# Altium schematic sheet USBC.SchDoc
size A
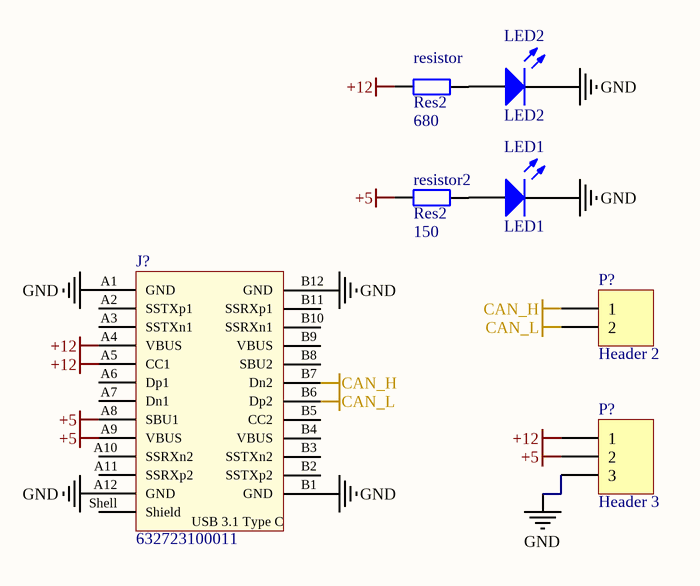
[diagram p0: USBC.SchDoc]

## Parts
(Parts that share a designator on the sheet are numbered #1, #2 ... from top to bottom, then left to right.)
J?  632723100011  [632723100011]
LED1  LED1  [LED-1]
LED2  LED2  [LED-1]
P?#1  Header 2  [HDR1X2]
P?#2  Header 3  [HDR1X3]
resistor  Res2  value 680  [AXIAL-0.4]
resistor2  Res2  value 150  [AXIAL-0.4]

## Nets
+5: J?.A8(SBU1) J?.A9(VBUS) P?#2.2 resistor2.1
+12: J?.A4(VBUS) J?.A5(CC1) P?#2.1 resistor.1
CAN_H: J?.B7(Dn2) P?#1.1
CAN_L: J?.B6(Dp2) P?#1.2
GND: J?.A1(GND) J?.A12(GND) J?.B1(GND) J?.B12(GND) LED1.2(K) LED2.2(K) P?#2.3
NetLED1_1: LED1.1(A) resistor2.2
NetLED2_1: LED2.1(A) resistor.2

Not connected (* = marked no-connect by the designer): J? A2(SSTXp1) A3(SSTXn1) A6(Dp1) A7(Dn1) A10(SSRXn2) A11(SSRXp2) B2(SSTXp2) B3(SSTXn2) B4(VBUS) B5(CC2) B8(SBU2) B9(VBUS) B10(SSRXn1) B11(SSRXp1) Shell(Shield)

## Notes on the sheet
- (in symbol 632723100011) USB 3.1 Type C

## Library data of the parts
J? = 632723100011: USB 3.1 Type C Receptacle Horizontal THR WR-COM; Interface Type: Type C; Sub-Family: USB 3.1; ComponentLink1Description: Manufacturer; ComponentLink1URL: http://www.we-online.de; ComponentLink2Description: Datasheet; ComponentLink2URL: http://katalog.we-online.de/em/datasheet/632723x00011.pdf; Part Number: 632723100011; Published Date: April 2017; Publisher: Wurth Elektronik; Gender: Receptacle; Type: Horizontal; Construction: THR
LED1 LED2 = LED1: Typical RED GaAs LED; Published: 8-Jun-2000; LatestRevisionDate: 08-Jul-2005; LatestRevisionNote: Mech Layer 1 removed.; PackageReference: LED-1; Publisher: Altium Limited; PackageDescription: LED; 2 Leads
P?#1 = Header 2: Header, 2-Pin; LatestRevisionDate: 17-Jul-2002; LatestRevisionNote: Re-released for DXP Platform.; Publisher: Altium Limited
P?#2 = Header 3: Header, 3-Pin; LatestRevisionDate: 17-Jul-2002; LatestRevisionNote: Re-released for DXP Platform.; Publisher: Altium Limited
resistor resistor2 = Res2: Resistor; Published: 8-Jun-2000; LatestRevisionDate: 17-Jul-2002; LatestRevisionNote: Re-released for DXP Platform.; PackageReference: AXIAL-0.4; Publisher: Altium Limited; PackageDescription: Axial Device, Thru-Hole; 2 Leads; 0.4 in Pin Spacing